# EAGLE design color_sensor (EAGLE 6.1)
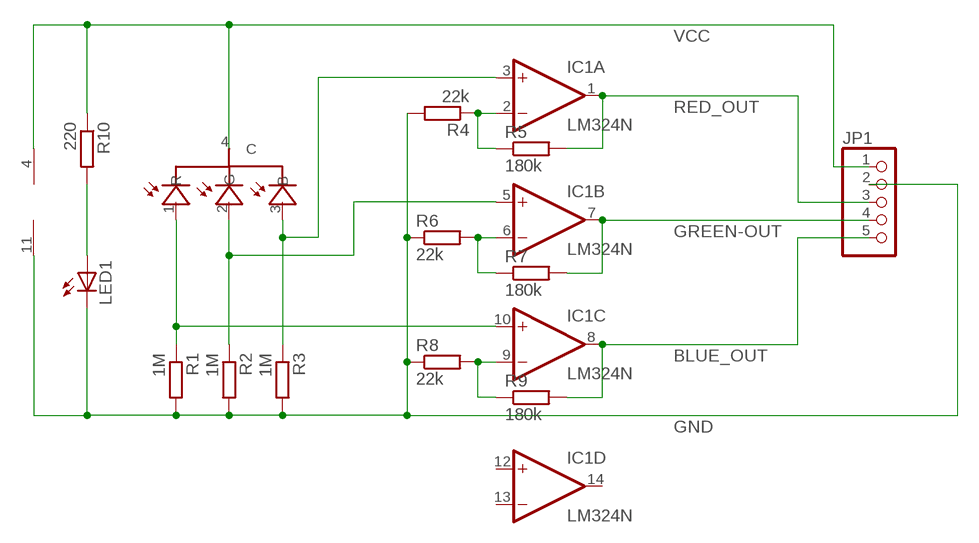
[diagram p0: schematic, sheet 1]

## Parts
IC1  LM324N  [DIL14]
JP1  PINHD-1X5  [1X05]
LED1  LED5MM  [LED5MM]
R1  1M  R-EU_0207/10  [0207/10]
R2  1M  R-EU_0207/10  [0207/10]
R3  1M  R-EU_0207/10  [0207/10]
R4  22k  R-EU_0207/10  [0207/10]
R5  180k  R-EU_0207/10  [0207/10]
R6  22k  R-EU_0207/10  [0207/10]
R7  180k  R-EU_0207/10  [0207/10]
R8  22k  R-EU_0207/10  [0207/10]
R9  180k  R-EU_0207/10  [0207/10]
R10  220  R-EU_0207/10  [0207/10]
U$1  KPS-5130PD7C  [KPS-5130PD7C]

## Nets
BLUE_OUT: IC1.8(C:OUT) JP1.5 R9.2
GND: IC1.11(P:V-) JP1.2 LED1.K(C) R1.2 R2.2 R3.2 R4.2 R6.1 R8.1
GREEN-OUT: IC1.7(B:OUT) JP1.4 R7.2
N$1: IC1.10(C:+IN) R1.1 U$1.1(R)
N$2: IC1.5(B:+IN) R2.1 U$1.2(G)
N$3: IC1.3(A:+IN) R3.1 U$1.3(B)
N$4: LED1.A R10.2
N$7: IC1.2(A:-IN) R4.1 R5.1
N$8: IC1.6(B:-IN) R6.2 R7.1
N$11: IC1.9(C:-IN) R8.2 R9.1
RED_OUT: IC1.1(A:OUT) JP1.3 R5.2
VCC: IC1.4(P:V+) JP1.1 R10.1 U$1.4(C)
Unconnected: IC1.12(D:+IN) IC1.13(D:-IN) IC1.14(D:OUT)

## Library data of the parts
IC1 = linear:LM324: OP AMP
JP1 = pinhead:PINHD-1X5: PIN HEADER
LED1 = led:LED: LED OSRAM: - CHIPLED LG R971, LG N971, LY N971, LG Q971, LY Q971, LO R971, LY R971 LH N974, LH R974 LS Q976, LO Q976, LY Q976 LO Q996 - Hyper CHIPLED LW Q18S LB Q993, LB Q99A, LB R99A - SideLED LS A670, LO A670, LY A670, LG A670, LP A670 LB A673, LV A673, LT A673, LW A673 LH A674 LY A675 LS A676, LA A676, LO A676, LY A676, LW A676 LS A679, LY A679, LG A679 - Hyper Micro SIDELED® LS Y876, LA Y876, LO Y876, LY Y876 LT Y87S - SmartLED LW L88C, LW L88S LB L89C, LB L89S, LG L890 LS L89K, LO L89K, LY L89K LS L896, LA L896, LO L896, LY L896 - TOPLED LS T670, LO T670, LY T670, LG T670, LP T670 LSG T670, LSP T670, LSY T670, LOP T670, LYG T670 LG T671, LOG T671, LSG T671 LB T673, LV T673, LT T673, LW T673 LH T674 LS T676, LA T676, LO T676, LY T676, LB T676, LH T676, LSB T676, LW T676 LB T67C, LV T67C, LT T67C, LS T67K, LO T67K, LY T67K, LW E67C LS E67B, LA E67B, LO E67B, LY E67B, LB E67C, LV E67C, LT E67C LW T67C LS T679, LY T679, LG T679 LS T770, LO T770, LY T770, LG T770, LP T770 LB T773, LV T773, LT T773, LW T773 LH T774 LS E675, LA E675, LY E675, LS T675 LS T776, LA T776, LO T776, LY T776, LB T776 LHGB T686 LT T68C, LB T68C - Hyper Mini TOPLED® LB M676 - Mini TOPLED Santana® LG M470 LS M47K, LO M47K, LY M47K Source: http://www.osram.convergy.de LUXEON: - LUMILED® LXK2-PW12-R00, LXK2-PW12-S00, LXK2-PW14-U00, LXK2-PW14-V00 LXK2-PM12-R00, LXK2-PM12-S00, LXK2-PM14-U00 LXK2-PE12-Q00, LXK2-PE12-R00, LXK2-PE12-S00, LXK2-PE14-T00, LXK2-PE14-U00 LXK2-PB12-K00, LXK2-PB12-L00, LXK2-PB12-M00, LXK2-PB14-N00, LXK2-PB14-P00, LXK2-PB14-Q00 LXK2-PR12-L00, LXK2-PR12-M00, LXK2-PR14-Q00, LXK2-PR14-R00 LXK2-PD12-Q00, LXK2-PD12-R00, LXK2-PD12-S00 LXK2-PH12-R00, LXK2-PH12-S00 LXK2-PL12-P00, LXK2-PL12-Q00, LXK2-PL12-R00 Source: www.luxeon.com KINGBRIGHT: KA-3528ASYC Source: www.kingbright.com
R1-R10 = resistor:R-EU_: RESISTOR, European symbol
U$1 = KPS-5130PD7C:KPS-5130PD7C

## Board
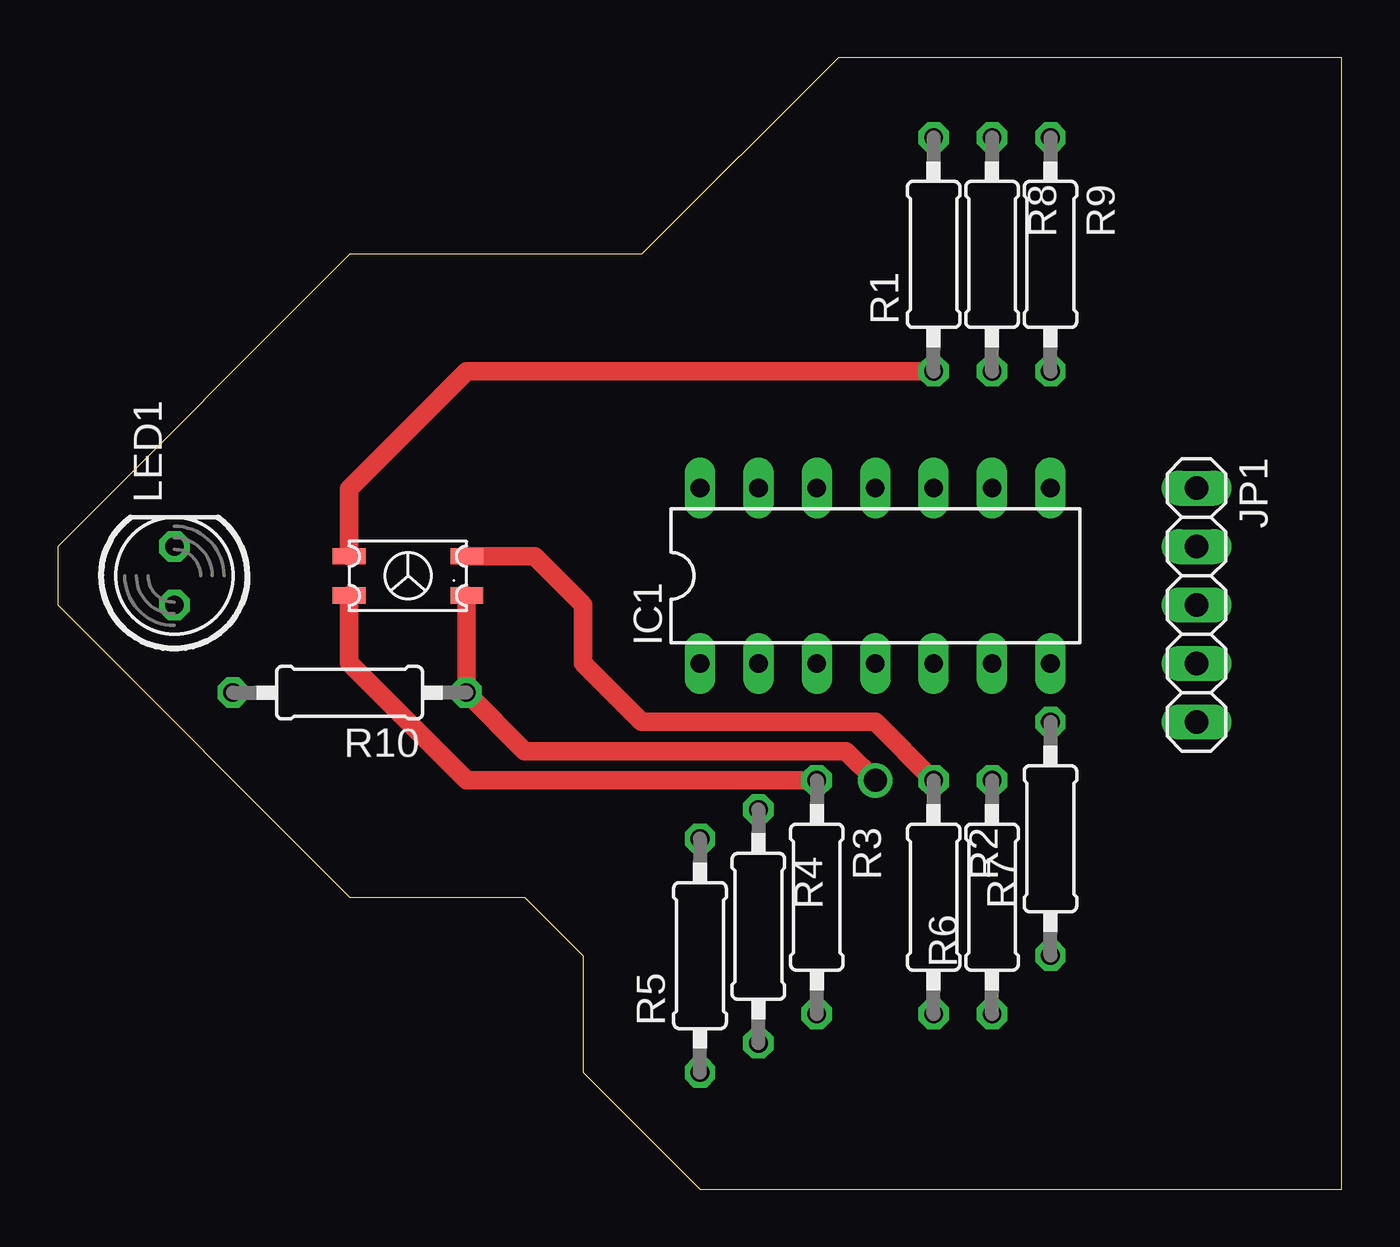
[diagram p1: board, top side]
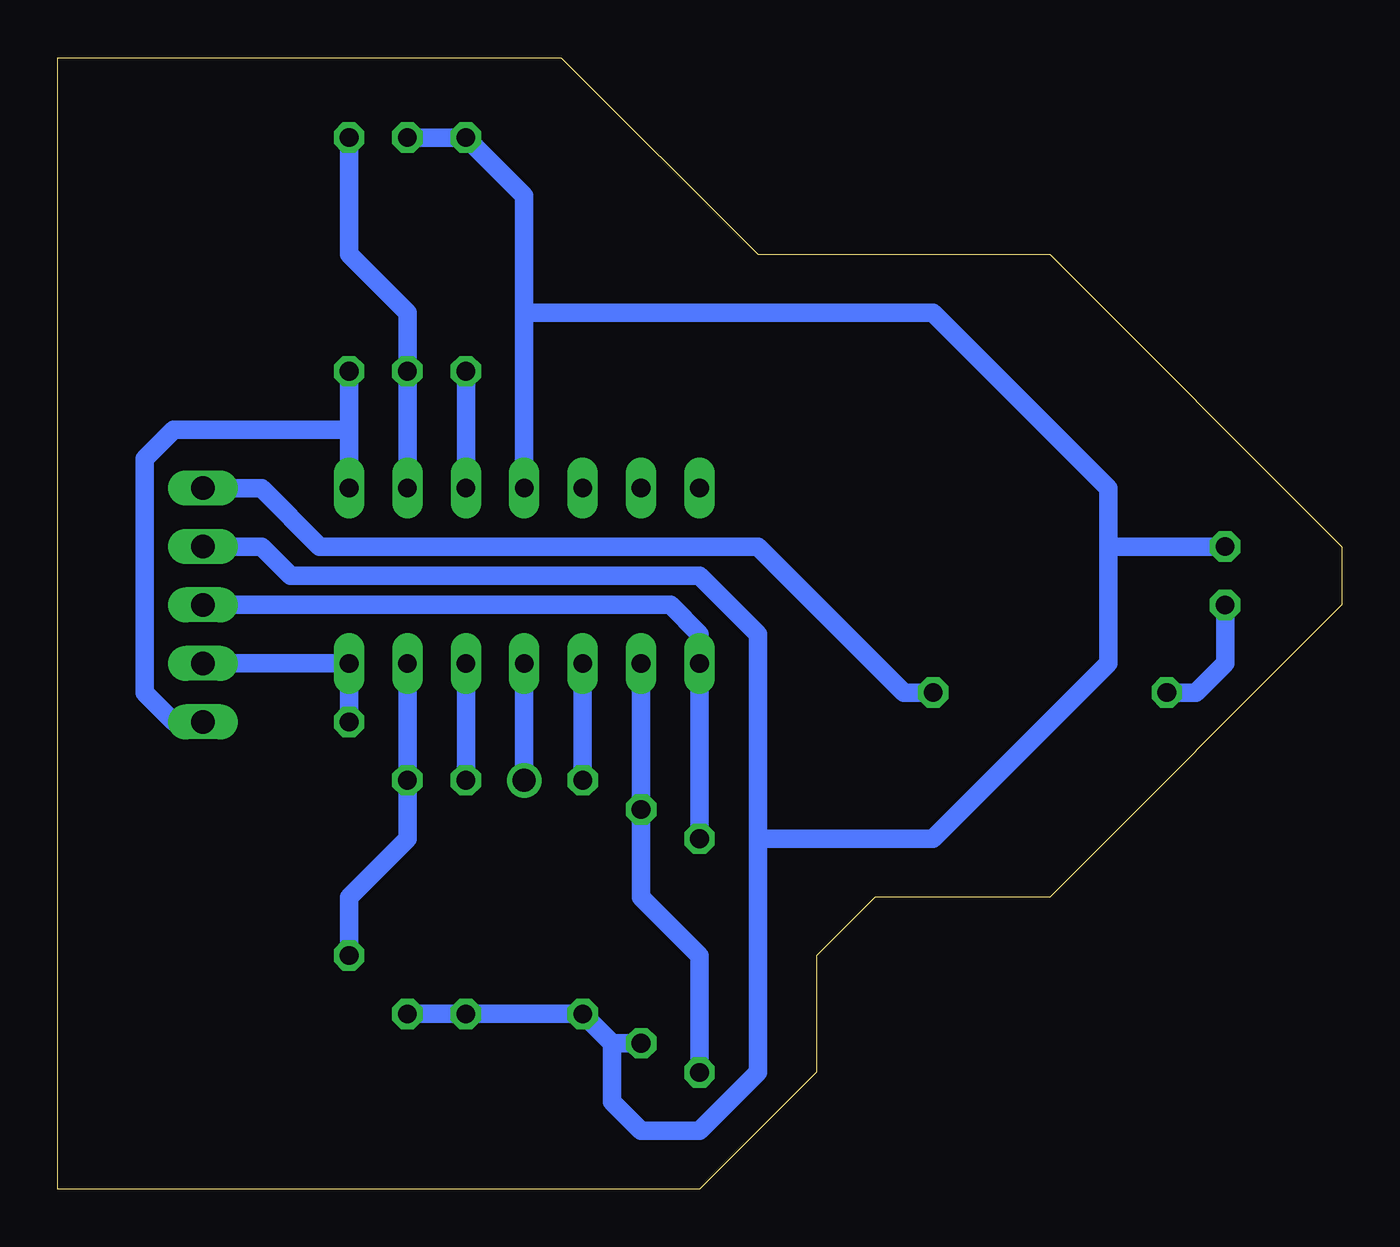
[diagram p2: board, bottom side, seen from below]

Size 55.86 x 49.2 mm. Coordinates in mm from the lower left corner, seen from the top.
Outline: 27.94,0 55.86,0 55.86,49.2 33.96,49.2 25.4,40.64 12.7,40.64 0,27.94 0,25.4 12.7,12.7 20.32,12.7 22.86,10.16 22.86,5.08 27.94,0
Copper layers (1*16): Top 0.035mm / dielectric 1.5mm / Bottom 0.035mm
Design rules: minimum track width 10mil, minimum drill 24mil, track to track 8mil, track to pad 8mil, pad to pad 8mil, via to via 8mil, smd to smd 8mil, copper to edge 40mil, drill to drill 8mil, minimum pad ring 10mil, minimum via ring 8mil, stop-mask expansion 4mil, vias tented up to drill 0mil, thermal gap 10mil

### Footprints (pad centres in the part's own frame; a part is rotated, then mirrored left to right if it is on the bottom)
DIL14 = drill 0.813 long: 1 -7.62,-3.81; 2 -5.08,-3.81; 3 -2.54,-3.81; 4 0,-3.81; 5 2.54,-3.81; 6 5.08,-3.81; 7 7.62,-3.81; 8 7.62,3.81; 9 5.08,3.81; 10 2.54,3.81; 11 0,3.81; 12 -2.54,3.81; 13 -5.08,3.81; 14 -7.62,3.81
1X05 = drill 1.016 long: 1 -5.08,0; 2 -2.54,0; 3 0,0; 4 2.54,0; 5 5.08,0
LED5MM = drill 0.813 octagon: A -1.27,0; K 1.27,0
0207/10 = drill 0.813 octagon: 1 -5.08,0; 2 5.08,0
KPS-5130PD7C = smd 1.422 x 0.711: 1 -2.56,0.85; 2 2.56,0.85; 3 -2.56,-0.85; 4 2.56,-0.85

### Placement (x,y rotation side)
IC1  35.56,26.67 0 top
JP1  49.53,25.4 270 top
LED1  5.08,26.67 90 top
R1  38.1,40.64 90 top
R2  38.1,12.7 270 top
R3  33.02,12.7 270 top
R4  30.48,11.43 270 top
R5  27.94,10.16 90 top
R6  40.64,12.7 90 top
R7  43.18,15.24 90 top
R8  40.64,40.64 270 top
R9  43.18,40.64 270 top
R10  12.7,21.59 180 top
U$1  15.24,26.67 0 top

### Tracks (layer width: path | path; a pad name or v marks a point on that pad's centre or on a via)
BLUE_OUT
  Bottom 0.813: IC1.8 43.18,33.02 | 43.18,33.02 R9.2 | JP1.5 50.8,20.32 52.07,21.59 52.07,31.75 50.8,33.02 43.18,33.02
GND
  Bottom 0.813: R4.2 31.75,6.35 | 31.75,6.35 R3.2 R2.2 R6.1 | R8.1 R1.2 35.56,43.18 35.56,38.1 | JP1.2 46.99,27.94 45.72,26.67 27.94,26.67 25.4,24.13 25.4,15.24 | 25.4,15.24 25.4,5.08 27.94,2.54 30.48,2.54 31.75,3.81 31.75,6.35 | 35.56,38.1 17.78,38.1 10.16,30.48 10.16,27.94 | 10.16,27.94 10.16,22.86 17.78,15.24 25.4,15.24 | IC1.11 35.56,38.1 | LED1.K 10.16,27.94
GREEN-OUT
  Bottom 0.813: R7.2 IC1.7 JP1.4
N$1
  Top 0.813: U$1.1 12.68,30.46 17.78,35.56 R1.1
  Bottom 0.813: R1.1 IC1.10
N$2
  Top 0.813: U$1.2 20.74,27.52 22.86,25.4 22.86,22.86 25.4,20.32 35.56,20.32 R2.1
  Bottom 0.813: R2.1 IC1.5
N$3
  Top 0.813: U$1.3 12.68,22.88 17.78,17.78 R3.1
  Bottom 0.813: R3.1 IC1.3
N$4
  Bottom 0.813: LED1.A 5.08,22.86 6.35,21.59 R10.2
N$7
  Bottom 0.813: R5.1 27.94,10.16 30.48,12.7 R4.1 IC1.2
N$8
  Bottom 0.813: IC1.6 R6.2 40.64,15.24 43.18,12.7 R7.1
N$11
  Bottom 0.813: R9.1 43.18,40.64 40.64,38.1 R8.2 IC1.9
RED_OUT
  Bottom 0.813: R5.2 IC1.1 27.94,24.13 29.21,25.4 JP1.3
VCC  (via drill 1)
  Top 0.813: U$1.4 17.78,25.8 R10.1 20.32,19.05 34.29,19.05 v35.56,17.78
  Bottom 0.813: R10.1 19.05,21.59 25.4,27.94 44.45,27.94 46.99,30.48 JP1.1 | IC1.4 v35.56,17.78